# EAGLE design phoboardv1 (EAGLE 7.5.0)
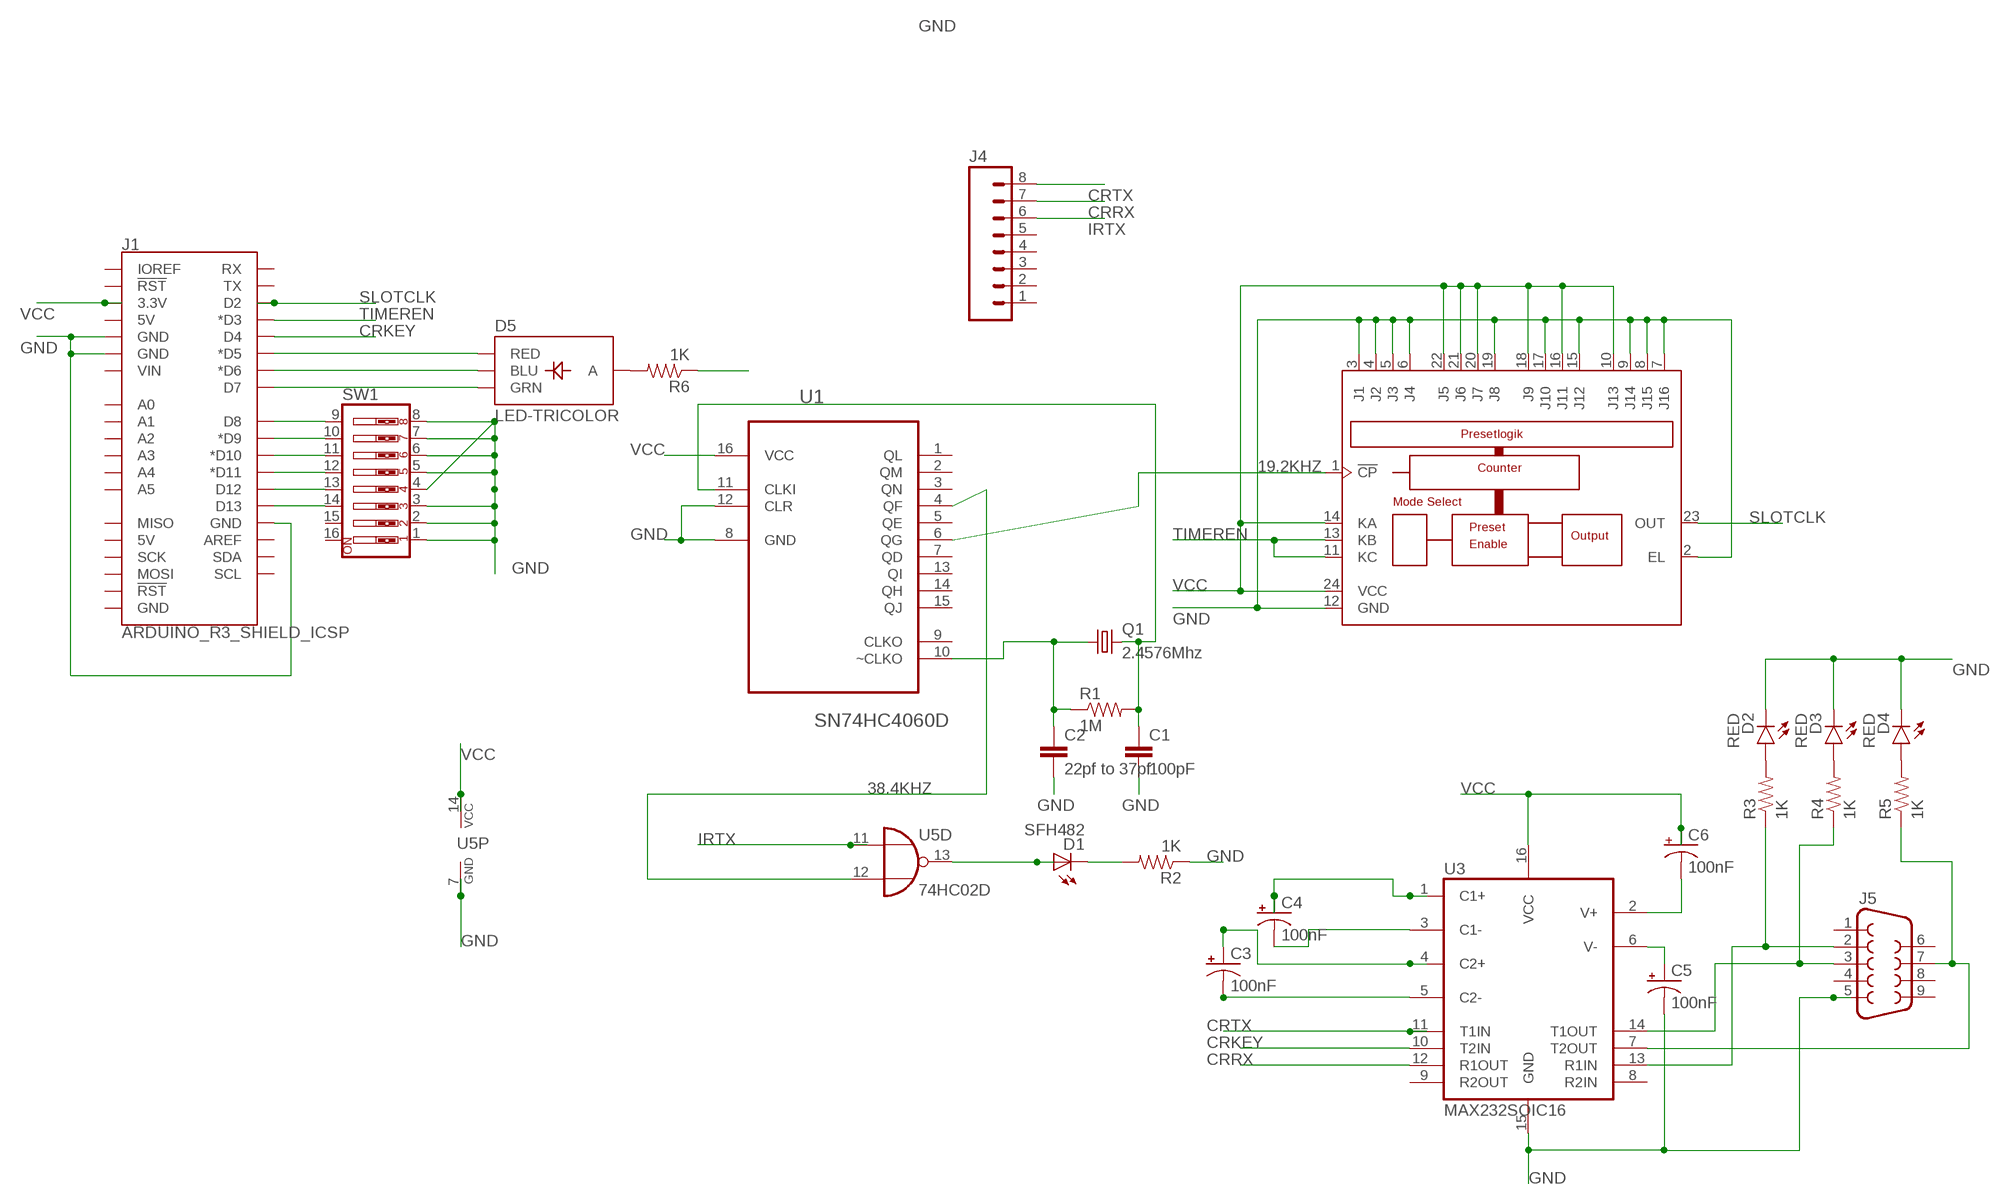
[diagram p0: schematic, sheet 1]

## Parts
C1  100pF  0.1UF-50V-20%(PTH)KIT-EZ  [CAP-PTH-SMALL-KIT]
C2  22pf to 37pf  0.1UF-50V-20%(PTH)KIT-EZ  [CAP-PTH-SMALL-KIT]
C3  100nF  CAP_POL1206  [EIA3216]
C4  100nF  CAP_POL1206  [EIA3216]
C5  100nF  CAP_POL1206  [EIA3216]
C6  100nF  CAP_POL1206  [EIA3216]
D1  SFH482  [SFH482]
D2  RED  LED-RED0603  [LED-0603]
D3  RED  LED-RED0603  [LED-0603]
D4  RED  LED-RED0603  [LED-0603]
D5  LED-TRICOLOR  [LED-TRICOLOR-SMD]
J1  ARDUINO_R3_SHIELD_ICSP  [UNO_R3_SHIELD_ICSP]
J4  M08  [1X08_ROUND]
J5  DB9MALE  [DB9_MALE]
Q1  2.4576Mhz  CRYSTALHC49U70  [HC49U70]
R1  1M  RESISTORPTH-1/4W  [AXIAL-0.4]
R2  1K  1KOHM-1/10W-1%(0603)  [0603-RES]
R3  1K  1KOHM-1/10W-1%(0603)  [0603-RES]
R4  1K  1KOHM-1/10W-1%(0603)  [0603-RES]
R5  1K  1KOHM-1/10W-1%(0603)  [0603-RES]
R6  1K  1KOHM-1/10W-1%(0603)  [0603-RES]
SW1  SW_DIP-8  [DIPSWITCH-08]
U1  SN74HC4060D  [SOIC127P600X175-16N]
U2  74HC59D  [SO24W]
U3  MAX232SOIC16  [SO016]
U5  74HC02D  [SO14]

## Nets
19.2KHZ: U1.6(QG) U2.1(!CP)
38.4KHZ: U1.4(QF) U5.12(D:I1)
CRKEY: J1.D4 U3.10(T2IN)
CRRX: J4.7 U3.12(R1OUT)
CRTX: J4.8 U3.11(T1IN)
D5: D5.R(RED) J1.D5(*D5)
GND: C1.2 C2.2 C5.C(-) D2.C D3.C D4.C J1.GND@0(GND) J1.GND@1(GND) J1.GND@2(GND) J5.5 R2.1 R6.1 SW1.1 SW1.2 SW1.3 SW1.4 SW1.5 SW1.6 SW1.7 SW1.8 U1.8(GND) U1.12(CLR) U2.2(EL) U2.3(J1) U2.4(J2) U2.5(J3) U2.6(J4) U2.7(J16) U2.8(J15) U2.9(J14) U2.12(GND) U2.15(J12) U2.17(J10) U2.19(J8) U3.15(GND) U5.7(P:GND)
IRTX: J4.6 U5.11(D:I0)
N$1: C2.1 Q1.1 R1.P$1 U1.10(~CLKO)
N$2: C1.1 Q1.2 R1.P$2 U1.11(CLKI)
N$4: D1.A U5.13(D:O)
N$5: D1.K(C) R2.2
N$6: J5.2 R3.1 U3.13(R1IN)
N$7: J5.3 R4.1 U3.14(T1OUT)
N$8: J5.7 R5.1 U3.7(T2OUT)
N$9: C3.C(-) U3.5(C2-)
N$10: C3.A(+) U3.4(C2+)
N$11: C4.C(-) U3.3(C1-)
N$12: C4.A(+) U3.1(C1+)
N$13: D5.B(BLU) J1.D6(*D6)
N$14: C6.C(-) U3.2(V+)
N$15: C5.A(+) U3.6(V-)
N$16: D5.G(GRN) J1.D7
N$17: J1.D8 SW1.9
N$18: D2.A R3.2
N$19: D3.A R4.2
N$20: D4.A R5.2
N$21: D5.A R6.2
N$22: J1.D9(*D9) SW1.10
N$23: J1.D10(*D10) SW1.11
N$24: J1.D11(*D11) SW1.12
N$25: J1.D12 SW1.13
N$26: J1.D13 SW1.14
SLOTCLK: J1.D2 U2.23(OUT)
TIMEREN: J1.D3(*D3) U2.11(KC) U2.13(KB)
VCC: C6.A(+) J1.3.3V U1.16(VCC) U2.10(J13) U2.14(KA) U2.16(J11) U2.18(J9) U2.20(J7) U2.21(J6) U2.22(J5) U2.24(VCC) U3.16(VCC) U5.14(P:VCC)
Unconnected: J1.5V J1.5V_ICSP(5V) J1.A0 J1.A1 J1.A2 J1.A3 J1.A4 J1.A5 J1.AREF J1.GND_ICSP(GND) J1.IOREF J1.MISO J1.MOSI J1.RES(!RST!) J1.RST_ICSP(!RST!) J1.RX J1.SCK J1.SCL J1.SDA J1.TX J1.VIN J4.1 J4.2 J4.3 J4.4 J4.5 J5.1 J5.4 J5.6 J5.8 J5.9 SW1.15 SW1.16 U1.1(QL) U1.2(QM) U1.3(QN) U1.5(QE) U1.7(QD) U1.9(CLKO) U1.13(QI) U1.14(QH) U1.15(QJ) U3.8(R2IN) U3.9(R2OUT) U5.1(A:O) U5.2(A:I0) U5.3(A:I1) U5.4(B:O) U5.5(B:I0) U5.6(B:I1) U5.8(C:I0) U5.9(C:I1) U5.10(C:O)

## Library data of the parts
C1 C2 = SparkFun-Capacitors:0.1UF-50V-20%(PTH): CAP-08370; PROD_ID: CAP-08370
C3-C6 = SparkFun-Capacitors:CAP_POL: Capacitor Polarized These are standard SMD and PTH capacitors. Normally 10uF, 47uF, and 100uF in electrolytic and tantalum varieties. Always verify the external diameter of the through hole cap, it varies with capacity, voltage, and manufacturer. The EIA devices should be standard.
D1 = led:SFH482: IR LED infrared emitting diode, Infineon
D2-D4 = SparkFun-LED:LED-RED: Assorted Red LEDs LilyPad 1206- DIO-09912 1206- DIO-00809 0603- DIO-00819 "SMART" means more efficient and expensive; PROD_ID: DIO-00819
D5 = SparkFun-LED:LED-TRICOLOR: Tri-Color LED SMD Proven layout and schematic for triple color LED in SMD package - common anode. Spark Fun Electronics SKU : COM-07844
J1 = SparkFun-Boards:ARDUINO_R3_SHIELD_ICSP: Arduino R3 Shield Footprint w/ 6-pin (2x3) ICSP Header
J4 = SparkFun-Connectors:M08: Header 8 Standard 8-pin 0.1" header. Use with straight break away headers (SKU : PRT-00116), right angle break away headers (PRT-00553), swiss pins (PRT-00743), machine pins (PRT-00117), and female headers (PRT-00115).; PROD_ID: CONN-08437
J5 = SparkFun-Connectors:DB9: DB9 Connector Standard DB9 (D-Sub 9) serial connector. Can be used for CAN bus as well as RS485 and RS232. Footprint production proven. Spark Fun Electronics SKU : PRT-00429; PROD_ID: CONN-09904
Q1 = crystal:CRYSTAL: CRYSTAL; OC_FARNELL: unknown; OC_NEWARK: unknown
R1 = SparkFun-Passives:RESISTOR: Resistor Basic schematic elements and footprints for 0603, 1206, and PTH resistors.
R2-R6 = SparkFun-Resistors:1KOHM-1/10W-1%(0603): RES-07856; PROD_ID: RES-07856
SW1 = SparkFun-Electromechanical:SW_DIP-8: DIP Switch 8 Position
U1 = Texas Instruments_By_element14_Batch_1:SN74HC4060D: 14 STAGE ASYNCHRONOUS BINARY COUNTERS AND OSCILLATORS; MPN: SN74HC4060D; OC_FARNELL: 1607672; OC_NEWARK: 76C3568; PACKAGE: SOIC-16; SUPPLIER: Texas Instruments
U2 = 74xx-eu:74*59: Devide by-N-Counter 74HC/HCT4059 Source: www.standardics.nxp.com/products/hc/datasheet/74hc4059.pdf
U3 = SparkFun-DigitalIC:MAX232: RS232 Transceiver Very common IC. This is generically called 'MAX232', but works with the 3V equivalent MAX3232 generic ICs. Field tested and mother approved. Spark Fun Electronics SKU : COM-00316 (DIP) and COM-00589 (SMD); PROD_ID: IC-08171
U5 = 74xx-eu:74*02: Quad 2-input NOR gate

## Net classes
0 default: clearance 0.205 mm

## Board
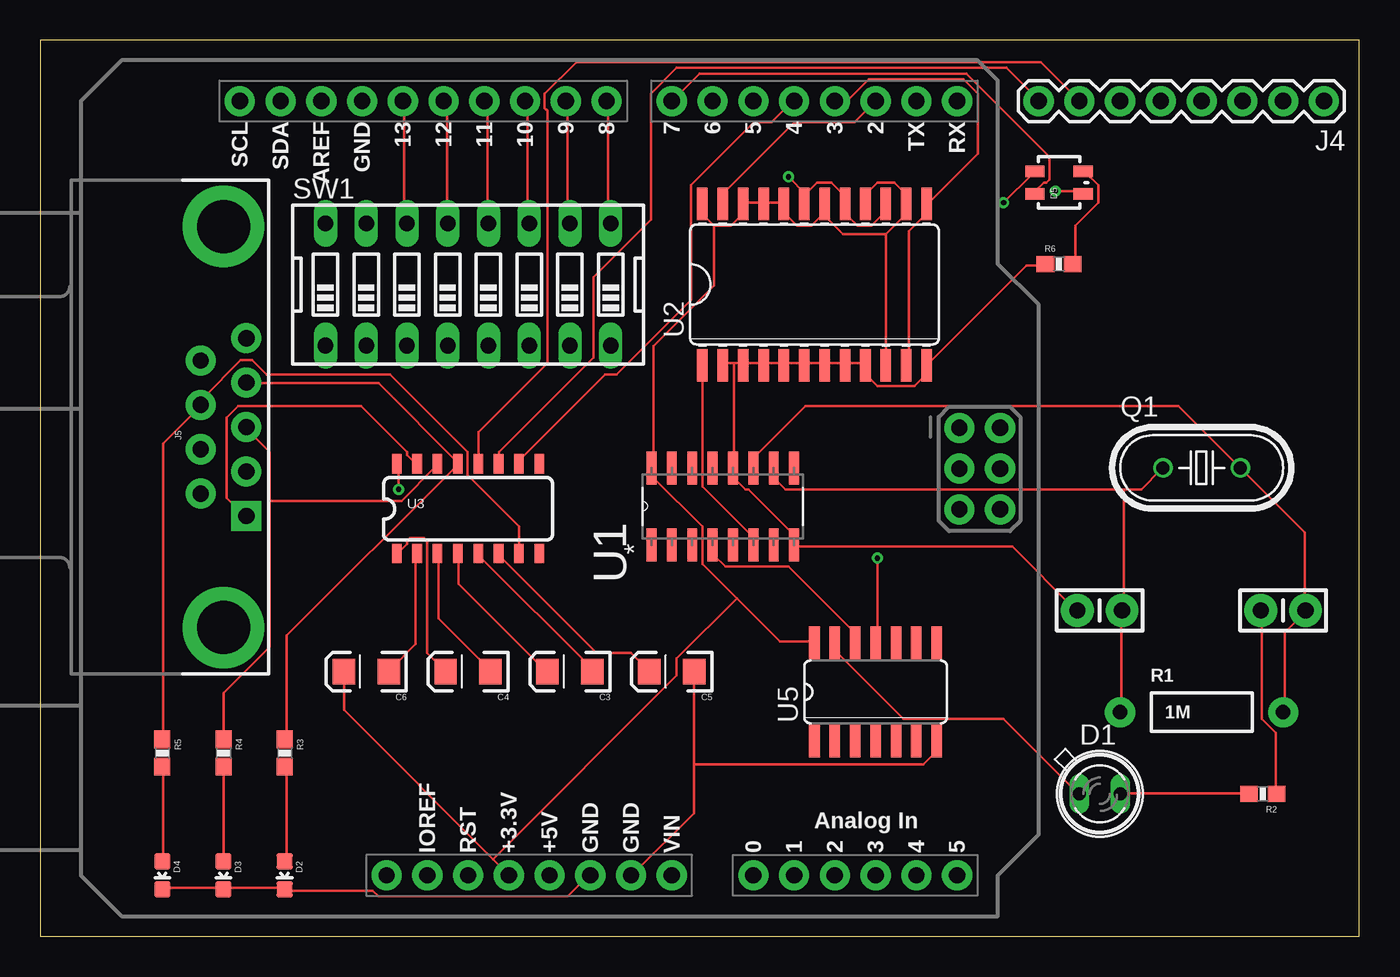
[diagram p1: board, top side]
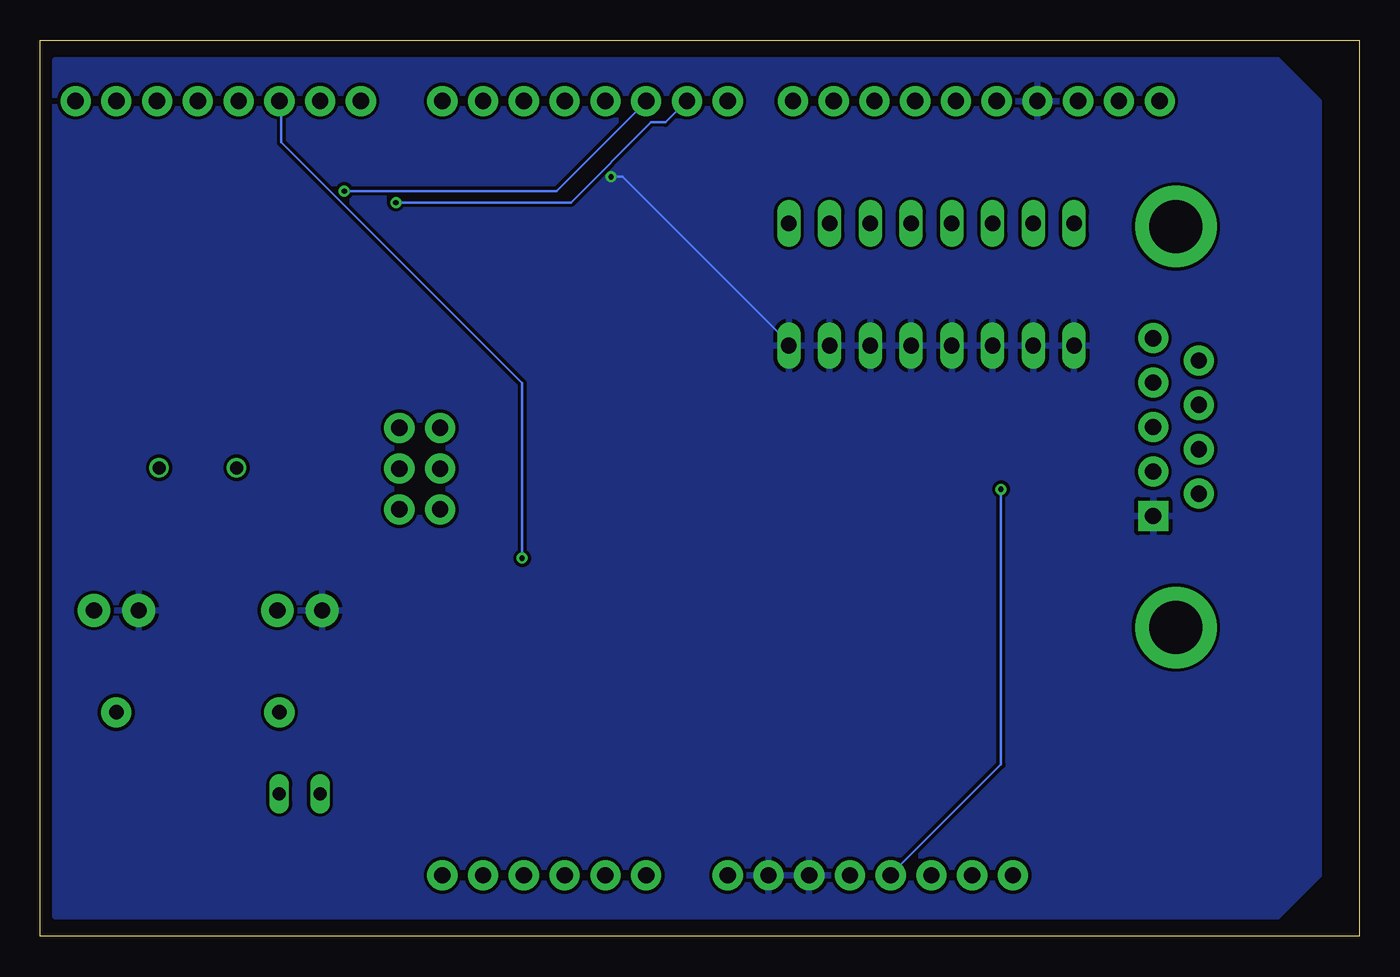
[diagram p2: board, bottom side, seen from below]

Size 82.22 x 55.87 mm. Coordinates in mm from the lower left corner, seen from the top.
Outline: 0,0 82.22,0 82.22,55.87 0,55.87 0,0
Copper layers (1*16): Top 0.0356mm / dielectric 1.5011mm / Bottom 0.0356mm
Design rules "LaenPCBOrder": minimum track width 6mil, minimum drill 13mil, track to track 6mil, track to pad 6mil, pad to pad 6mil, via to via 6mil, smd to smd 6mil, copper to edge 15mil, drill to drill 6mil, minimum pad ring 7mil, minimum via ring 7mil, stop-mask expansion 3mil, vias tented up to drill 0mil, thermal gap 10mil

### Footprints (pad centres in the part's own frame; a part is rotated, then mirrored left to right if it is on the bottom)
CAP-PTH-SMALL-KIT = drill 1.016 pad 2.032: 1 -1.397,0; 2 1.397,0
EIA3216 = smd 1.4 x 1.6: A 1.4,0; C -1.4,0
SFH482 = drill 0.813 long: A -1.27,0; K 1.27,0
LED-0603 = smd 1 x 1: A 0,-0.877; C 0,0.877
LED-TRICOLOR-SMD = smd 0.7 x 1.2: A 0.7,-1.5; B 0.7,1.5; G -0.7,1.5; R -0.7,-1.5
UNO_R3_SHIELD_ICSP = drill 1.016 pad 1.88: 3.3V 50.8,26.67; 5V 50.8,29.21; 5V_ICSP 22.91,57.29; A0 50.8,41.91; A1 50.8,44.45; A2 50.8,46.99; A3 50.8,49.53; A4 50.8,52.07; A5 50.8,54.61; AREF 2.54,14.986; D2 2.54,49.53; D3 2.54,46.99; D4 2.54,44.45; D5 2.54,41.91; D6 2.54,39.37; D7 2.54,36.83; D8 2.54,32.766; D9 2.54,30.226; D10 2.54,27.686; D11 2.54,25.146; D12 2.54,22.606; D13 2.54,20.066; GND@0 50.8,31.75; GND@1 50.8,34.29; GND@2 2.54,17.526; GND_ICSP 27.99,57.29; IOREF 50.8,21.59; MISO 22.91,54.75; MOSI 25.45,57.29; NC 50.8,19.05; RES 50.8,24.13; RST_ICSP 27.99,54.75; RX 2.54,54.61; SCK 25.45,54.75; SCL 2.54,9.906; SDA 2.54,12.446; TX 2.54,52.07; VIN 50.8,36.83
1X08_ROUND = drill 1.016 pad 1.88: 1 0,0; 2 2.54,0; 3 5.08,0; 4 7.62,0; 5 10.16,0; 6 12.7,0; 7 15.24,0; 8 17.78,0
DB9_MALE = drill 1.016 pad 1.88: 1 5.54,-1.42; 2 2.77,-1.42; 3 0,-1.42; 4 -2.77,-1.42; 6 4.15,1.42; 7 1.38,1.42; 8 -1.38,1.42; 9 -4.15,1.42 | drill 1.016 pad 1.88 square: 5 -5.54,-1.42 | drill 3.302 pad 5.08: G1 -12.5,0; G2 12.5,0
HC49U70 = drill 0.813: 1 -2.413,0; 2 2.413,0
AXIAL-0.4 = drill 0.9 pad 1.88: P$1 -5.08,0; P$2 5.08,0
0603-RES = smd 1.1 x 1: 1 -0.85,0; 2 0.85,0
DIPSWITCH-08 = drill 0.97 long: 1 -8.89,-3.81; 2 -6.35,-3.81; 3 -3.81,-3.81; 4 -1.27,-3.81; 5 1.27,-3.81; 6 3.81,-3.81; 7 6.35,-3.81; 8 8.89,-3.81; 9 8.89,3.81; 10 6.35,3.81; 11 3.81,3.81; 12 1.27,3.81; 13 -1.27,3.81; 14 -3.81,3.81; 15 -6.35,3.81; 16 -8.89,3.81
SOIC127P600X175-16N = smd 2.057 x 0.61: 1 -4.801,8.89; 2 -4.801,7.62; 3 -4.801,6.35; 4 -4.801,5.08; 5 -4.801,3.81; 6 -4.801,2.54; 7 -4.801,1.27; 8 -4.801,0; 9 0,0; 10 0,1.27; 11 0,2.54; 12 0,3.81; 13 0,5.08; 14 0,6.35; 15 0,7.62; 16 0,8.89
SO24W = smd 0.66 x 2.032: 1 -6.985,-5.029; 2 -5.715,-5.029; 3 -4.445,-5.029; 4 -3.175,-5.029; 5 -1.905,-5.029; 6 -0.635,-5.029; 7 0.635,-5.029; 8 1.905,-5.029; 9 3.175,-5.029; 10 4.445,-5.029; 11 5.715,-5.029; 12 6.985,-5.029; 13 6.985,5.029; 14 5.715,5.029; 15 4.445,5.029; 16 3.175,5.029; 17 1.905,5.029; 18 0.635,5.029; 19 -0.635,5.029; 20 -1.905,5.029; 21 -3.175,5.029; 22 -4.445,5.029; 23 -5.715,5.029; 24 -6.985,5.029
SO016 = smd 0.6 x 1.2: 1 -4.445,-2.8; 2 -3.175,-2.8; 3 -1.905,-2.8; 4 -0.635,-2.8; 5 0.635,-2.8; 6 1.905,-2.8; 7 3.175,-2.8; 8 4.445,-2.8; 9 4.445,2.8; 10 3.175,2.8; 11 1.905,2.8; 12 0.635,2.8; 13 -0.635,2.8; 14 -1.905,2.8; 15 -3.175,2.8; 16 -4.445,2.8
SO14 = smd 0.66 x 2.032: 1 -3.81,-3.073; 2 -2.54,-3.073; 3 -1.27,-3.073; 4 0,-3.073; 5 1.27,-3.073; 6 2.54,-3.073; 7 3.81,-3.073; 8 3.81,3.073; 9 2.54,3.073; 10 1.27,3.073; 11 0,3.073; 12 -1.27,3.073; 13 -2.54,3.073; 14 -3.81,3.073

### Placement (x,y rotation side)
C1  77.47,20.32 180 top
C2  66.04,20.32 180 top
C3  33.02,16.51 180 top
C4  26.67,16.51 180 top
C5  39.37,16.51 180 top
C6  20.32,16.51 180 top
D1  66.04,8.89 0 top
D2  15.24,3.81 180 top
D3  11.43,3.81 180 top
D4  7.62,3.81 180 top
D5  63.5,46.99 90 top
J1  2.54,54.61 270 top
J4  80.01,52.07 180 top
J5  11.43,31.75 90 top
Q1  72.39,29.21 0 top
R1  72.39,13.97 0 top
R2  76.2,8.89 180 top
R3  15.24,11.43 270 top
R4  11.43,11.43 270 top
R5  7.62,11.43 270 top
R6  63.5,41.91 0 top
SW1  26.67,40.64 0 top
U1  46.99,29.21 90 top
U2  48.26,40.64 0 top
U3  26.67,26.67 0 top
U5  52.07,15.24 0 top

### Tracks (layer width: path | path; a pad name or v marks a point on that pad's centre or on a via)
19.2KHZ
  Top 0.152: U2.1 41.28,35.56 41.28,28.05 44.32,25.01 44.32,24.48 U1.6
38.4KHZ
  Top 0.152: U5.12 50.75,18.4 50.75,18.94 46.64,23.05 42.71,23.05 41.99,23.76 41.99,24.3 U1.4
CRKEY
  Top 0.152: U3.10 30.02,29.48 30.02,29.84 35.2,35.02 35.92,35.02 40.56,39.67 40.56,46.81 44.5,50.75 45.57,50.75 46.82,52 J1.D4
CRRX
  Top 0.152: U3.12 27.34,29.48 27.34,31.45 31.63,35.73 31.63,51.46 31.45,51.64 31.45,52.53 33.42,54.5 62.37,54.5 64.69,52.18 J4.7
CRTX
  Top 0.152: U3.11 28.59,29.48 28.59,30.2 34.49,36.09 34.49,41.09 38.06,44.67 38.06,52.53 39.67,54.14 60.22,54.14 62.19,52.18 J4.8
D5  (via drill 0.33)
  Top 0.152: v63.26,46.46 64.87,46.46 D5.R
  Bottom 0.152: v63.26,46.46 50.04,46.46 44.5,52 J1.D5
GND  (via drill 0.33)
  Top 0.152: R6.1 62.55,41.81 61.47,41.81 55.4,35.73 U2.12 55.22,35.56 55.22,35.02 54.5,34.31 52.18,34.31 51.47,35.02 51.47,35.56 U2.9 51.29,35.73 50.22,35.73 U2.8 50.04,35.73 48.96,35.73 U2.7 48.78,35.73 47.71,35.73 U2.6 47.53,35.73 46.46,35.73 U2.5 46.28,35.73 45.21,35.73 U2.4 45.03,35.73 43.96,35.73 U2.3 43.78,35.73 43.24,35.73 | 43.24,35.73 42.71,35.73 U2.2 | 43.24,35.73 43.24,29.3 U1.12 43.24,29.12 43.24,28.59 43.96,27.87 44.14,27.87 46.82,25.19 46.82,24.48 U1.8 47,24.3 60.58,24.3 64.51,20.37 C2.2 | 47.71,46.28 47.71,45.74 U2.19 47.71,46.28 | 47.71,46.28 48.43,46.99 49.32,46.99 50.04,46.28 50.04,45.74 U2.17 50.22,45.56 50.22,45.03 50.93,44.31 51.82,44.31 52.54,45.03 52.54,45.56 U2.15 | D4.C 7.68,3.03 11.26,3.03 D3.C 11.44,3.03 15.19,3.03 D2.C 15.37,2.85 20.73,2.85 21.09,2.5 32.88,2.5 34.13,3.75 J1.GND@0 | R2.1 77.02,8.93 77.02,12.68 76.13,13.58 76.13,20.19 C1.2 | U3.15 23.41,29.48 22.87,30.02 22.87,30.2 20.01,33.05 12.33,33.05 11.62,32.34 11.62,27.34 12.69,26.26 J5.5 | 40.74,10.72 40.74,7.68 36.99,3.93 J1.GND@1 | 40.74,10.72 40.74,16.43 C5.C | 40.74,10.72 55.04,10.72 55.75,11.43 55.75,12.15 U5.7 | v46.64,47.35 47.71,46.28
  Bottom 0.152: v46.64,47.35 45.93,47.35 35.56,36.98 SW1.8
  pour Bottom: 2.54,52.07 5.08,54.61 81.28,54.61 81.28,1.27 5.08,1.27 2.54,3.81
IRTX  (via drill 0.33)
  Top 0.152: v52.18,23.58 52.18,18.4 U5.11
  Bottom 0.152: v52.18,23.58 52.18,34.48 67.19,49.49 67.19,52 J4.6
N$1
  Top 0.152: R1.P$1 67.37,14.11 67.37,20.19 C2.1 67.55,20.37 67.55,27.87 | 67.55,27.87 68.62,27.87 69.87,29.12 Q1.1 | 67.55,27.87 46.46,27.87 45.75,28.59 45.75,29.12 U1.10
N$2
  Top 0.152: R1.P$2 77.56,14.11 77.56,18.94 78.81,20.19 C1.1 78.81,20.37 78.81,25.19 74.88,29.12 Q1.2 74.7,29.3 70.94,33.05 47.71,33.05 44.5,29.84 44.5,29.3 U1.11
N$4
  Top 0.152: U5.13 49.68,18.22 49.68,17.69 53.79,13.58 60.04,13.58 64.69,8.93 D1.A
N$5
  Top 0.152: R2.2 75.23,8.93 67.37,8.93 D1.K
N$6
  Top 0.152: R3.1 15.37,12.32 15.37,18.76 25.91,29.3 U3.13 26.09,29.48 21.09,34.48 12.87,34.48 J5.2
N$7
  Top 0.152: 14.3,27.16 14.3,30.2 12.87,31.62 J5.3 | 14.3,27.16 14.3,18.04 11.44,15.18 11.44,12.32 R4.1 | 14.3,27.16 22.52,27.16 24.66,29.3 U3.14
N$8
  Top 0.152: R5.1 7.68,12.32 7.68,30.73 10.01,33.05 J5.7 10.19,33.23 10.19,33.59 12.51,35.91 13.22,35.91 14.12,35.02 21.8,35.02 26.63,30.2 26.63,28.77 29.84,25.55 29.84,23.94 U3.7
N$9
  Top 0.152: U3.5 27.34,23.76 34.49,16.61 C3.C
N$10
  Top 0.152: U3.4 26.09,23.76 26.09,21.97 31.45,16.61 C3.A
N$11
  Top 0.152: U3.3 24.84,23.76 24.84,19.83 28.06,16.61 C4.C
N$12
  Top 0.152: U3.1 22.34,23.94 22.87,24.48 22.87,24.65 23.05,24.83 23.95,24.83 24.12,24.65 24.12,17.69 25.2,16.61 C4.A
N$13  (via drill 0.33)
  Top 0.152: v60.04,45.74 61.83,47.53 D5.B
  Bottom 0.152: v60.04,45.74 49.14,45.74 44.14,50.75 43.24,50.75 41.99,52 J1.D6
N$14
  Top 0.152: U3.2 23.41,23.76 23.41,18.22 21.8,16.61 C6.C
N$15
  Top 0.152: U3.6 28.59,23.76 34.67,17.69 36.81,17.69 37.88,16.61 C5.A
N$16
  Top 0.152: D5.G 62.01,46.46 62.55,46.99 62.72,46.99 62.9,47.17 62.9,48.6 57.72,53.78 41.1,53.78 39.49,52.18 J1.D7
N$17
  Top 0.152: SW1.9 35.38,44.49 35.38,52 J1.D8
N$18
  Top 0.152: D2.A 15.37,4.82 15.37,10.54 R3.2
N$19
  Top 0.152: D3.A 11.44,4.82 11.44,10.54 R4.2
N$20
  Top 0.152: D4.A 7.68,4.82 7.68,10.54 R5.2
N$21
  Top 0.152: R6.2 64.51,41.99 64.51,44.31 65.94,45.74 65.94,46.81 65.05,47.71 D5.A
N$22
  Top 0.152: SW1.10 32.88,44.49 32.88,52 J1.D9
N$23
  Top 0.152: SW1.11 30.38,44.49 30.38,52 J1.D10
N$24
  Top 0.152: SW1.12 27.88,44.49 27.88,51.82 27.7,52 J1.D11
N$25
  Top 0.152: SW1.13 25.38,44.49 25.38,51.82 25.2,52 J1.D12
N$26
  Top 0.152: SW1.14 22.7,44.49 22.7,52 J1.D13
SLOTCLK
  Top 0.152: U2.23 42.71,45.74 42.71,46.46 47,50.75 50.75,50.75 52,52 J1.D2
TIMEREN
  Top 0.152: U2.11 54.15,35.73 54.15,43.95 55.22,45.03 55.22,45.56 U2.13 55.4,45.74 58.44,48.78 58.44,52.53 57.54,53.43 51.64,53.43 50.39,52.18 49.68,52.18 J1.D3
VCC  (via drill 0.33)
  Top 0.152: v22.34,27.87 22.34,29.3 U3.16 | 28.23,4.82 29.13,3.93 J1.3.3V | 28.23,4.82 18.94,14.11 18.94,16.43 C6.A | 43.42,21.08 41.28,23.22 41.28,25.55 38.24,28.59 38.24,29.12 U1.16 38.24,29.3 38.24,36.81 41.99,40.56 41.99,44.31 | 43.42,21.08 46.1,18.4 48.25,18.4 U5.14 | 41.99,44.31 41.28,45.03 41.28,45.56 U2.24 | 41.99,44.31 43.07,44.31 43.78,45.03 43.78,45.56 U2.22 43.96,45.74 45.03,45.74 U2.21 45.21,45.74 46.28,45.74 U2.20 46.46,45.56 46.46,45.03 47.18,44.31 48.07,44.31 48.78,45.03 | 48.78,45.03 48.78,45.56 U2.18 48.78,45.03 | U2.16 51.47,45.74 51.47,46.28 52.18,46.99 53.25,46.99 53.97,46.28 53.97,45.74 U2.14 53.97,45.56 53.97,45.03 52.72,43.78 | 52.72,43.78 52.72,35.73 U2.10 | 48.78,45.03 50.04,43.78 52.72,43.78 | 28.23,4.82 39.67,16.26 39.67,17.33 43.42,21.08
  Bottom 0.152: v22.34,27.87 22.34,10.72 29.13,3.93 J1.3.3V